# Altium schematic sheet DVM_TopLevel.SchDoc
size B; Organization: Mechanart, LLC; Address1: 397 Laurie Meadows Drive; Address2: Apt. 437; Address3: San Mateo, CA 94403
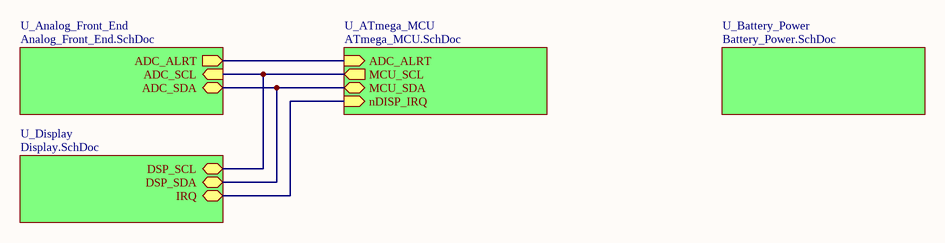
[diagram p0: DVM_TopLevel.SchDoc]

## Sub-sheets
U_Analog_Front_End = Analog_Front_End.SchDoc: ADC_ALRT (out), ADC_SCL (in), ADC_SDA (bidir)
U_ATmega_MCU = ATmega_MCU.SchDoc: ADC_ALRT (in), MCU_SDA (bidir), MCU_SCL (out), nDISP_IRQ (in)
U_Battery_Power = Battery_Power.SchDoc: no entries
U_Display = Display.SchDoc: DSP_SCL, DSP_SDA, IRQ

## Nets
(unnamed): sheet U_Analog_Front_End/ADC_ALRT, sheet U_ATmega_MCU/ADC_ALRT
(unnamed): sheet U_Analog_Front_End/ADC_SCL, sheet U_ATmega_MCU/MCU_SCL, sheet U_Display/DSP_SCL
(unnamed): sheet U_Analog_Front_End/ADC_SDA, sheet U_ATmega_MCU/MCU_SDA, sheet U_Display/DSP_SDA
(unnamed): sheet U_ATmega_MCU/nDISP_IRQ, sheet U_Display/IRQ

## Notes on the sheet
- Title
- Size:
- Date:
- B
- Number:
- Time:
- Revision:
- Sheet
- of
- File: